# Altium schematic sheet APX812-29UG7.SchDoc
size A; SheetNumber: 1; SheetTotal: 1
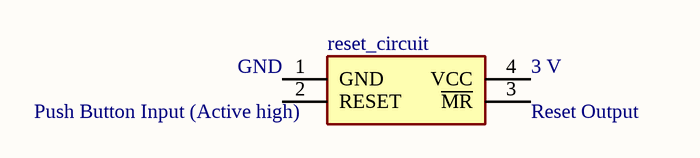
[diagram p0: APX812-29UG7.SchDoc]

## Parts
reset_circuit  APX812-29UG-7  [APX81229UG7]  (value not drawn)

## Nets

Not connected (* = marked no-connect by the designer): reset_circuit 1(GND) 2(RESET) 3(~{MR}) 4(VCC)

## Notes on the sheet
- (near reset_circuit) Push Button Input (Active high)
- (near reset_circuit) GND
- (near reset_circuit) 3 V
- (near reset_circuit) Reset Output

## Library data of the parts
reset_circuit = APX812-29UG-7: Supervisor Push-Pull, Totem Pole 1 Channel SOT-143 , 2.93V , 140ms , -40C ~ 85C (TA); Manufacturer_Name: Diodes Incorporated; Geometry.Height: 1.1mm; Manufacturer_Part_Number: APX812-29UG-7; Mouser Part Number: 621-APX812-29UG-7; Mouser Price/Stock: https://www.mouser.co.uk/ProductDetail/Diodes-Incorporated/APX812-29UG-7?qs=uwE%252BXfKqZqTVBV%252BbZr8J2A%3D%3D; Arrow Part Number: APX812-29UG-7; Arrow Price/Stock: https://www.arrow.com/en/products/apx812-29ug-7/diodes-incorporated; Datasheet Link: https://www.diodes.com//assets/Datasheets/APX811_812.pdf